# Altium project Thermal Camera.PrjPcb
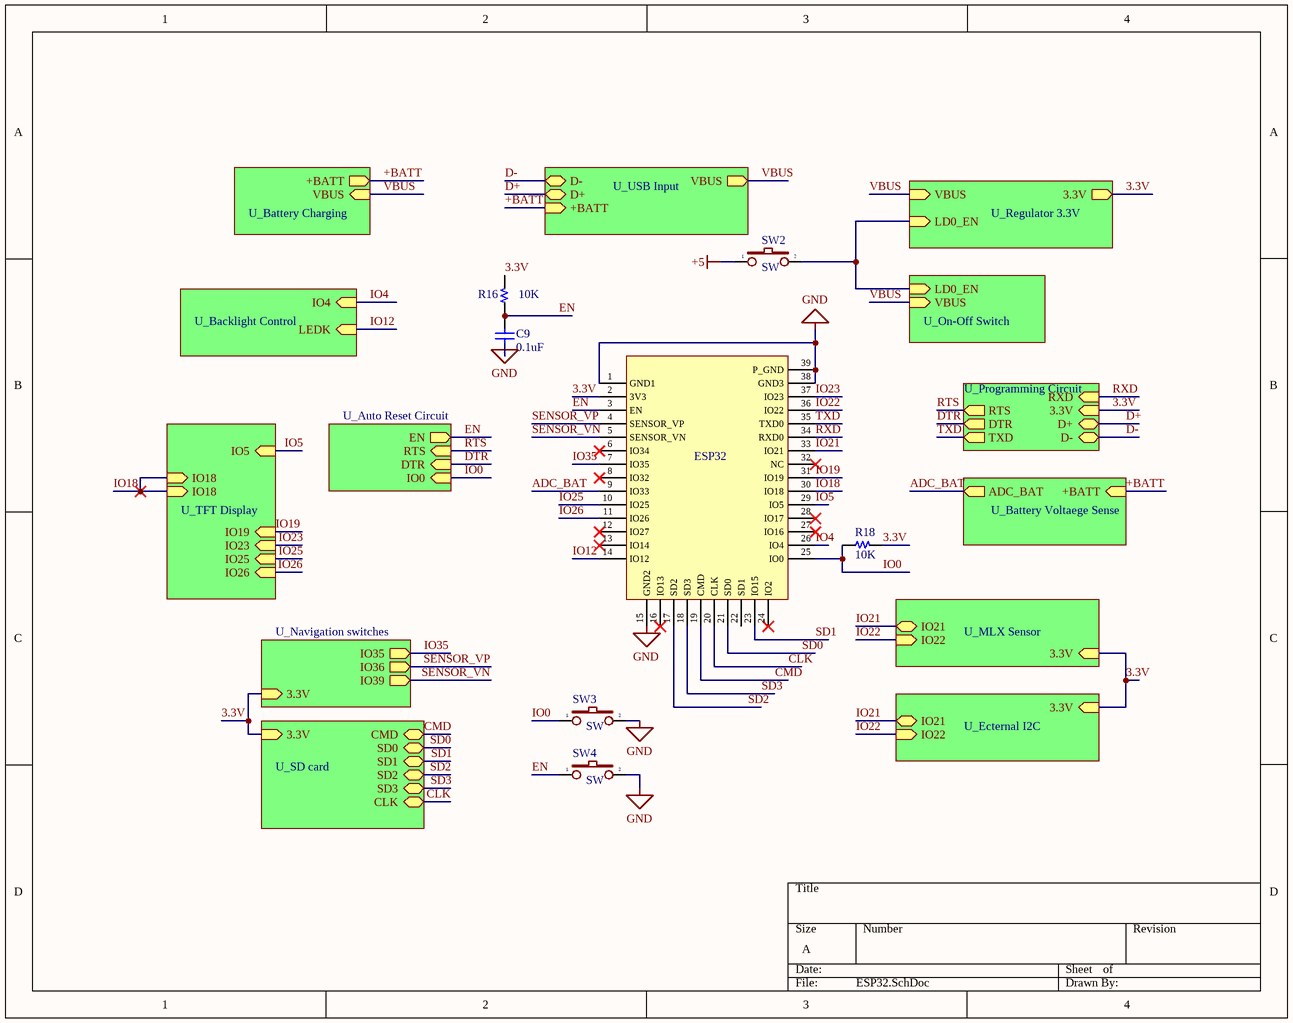
[diagram p0: ESP32.SchDoc]
12 sheets, 49 parts. Net scope: hierarchical (ports join the sheet entries above them; power ports are global).
Board file: PCB_Thermal.PcbDoc
Sheets:
  ESP32.SchDoc
    U_Programming Circuit = Programming Circuit.SchDoc
    U_Regulator 3.3V = Regulator 3.3V.SchDoc
    U_USB Input = USB Input.SchDoc
    U_Battery Voltaege Sense = Battery Voltaege Sense.SchDoc
    U_Backlight Control = Backlight Control.SchDoc
    U_MLX Sensor = MLX Sensor.SchDoc
    U_Navigation switches = Navigation switches.SchDoc
    U_On-Off Switch = On-Off Switch.SchDoc
    U_SD card = SD card.SchDoc
    U_TFT Display = TFT Display.SchDoc
    U_Battery Charging = Battery Charging.SchDoc

## Sheet ESP32.SchDoc
size A; SheetNumber: 1; SheetTotal: 14

### Parts
C9  0.1uF  [C 0805]
ESP32  ESP32  [ESP_WROOM_32]  (value not drawn)
R16  10K  [R 0805]
R18  10K  [R 0805]
SW2  SW  [SW2]
SW3  SW  [SW2]
SW4  SW  [SW2]

### Sub-sheets
U_Auto Reset Circuit = Auto Reset Circuit.SchDoc (file not in this document): IO0 (in), DTR (in), RTS (in), EN (out)
U_Backlight Control = Backlight Control.SchDoc: LEDK (in), IO4 (in)
U_Battery Charging = Battery Charging.SchDoc: VBUS (in), +BATT (out)
U_Battery Voltaege Sense = Battery Voltaege Sense.SchDoc: +BATT (in), ADC_BAT (out)
U_Ecternal I2C = Ecternal I2C.SchDoc (file not in this document): 3.3V (in), IO21 (bidir), IO22 (in)
U_MLX Sensor = MLX Sensor.SchDoc: 3.3V (in), IO21 (bidir), IO22 (in)
U_Navigation switches = Navigation switches.SchDoc: 3.3V (in), IO35 (out), IO36 (out), IO39 (out)
U_On-Off Switch = On-Off Switch.SchDoc: LD0_EN (in), VBUS (in)
U_Programming Circuit = Programming Circuit.SchDoc: D- (bidir), D+ (bidir), 3.3V (in), RXD (in), TXD (out), DTR (out), RTS (out)
U_Regulator 3.3V = Regulator 3.3V.SchDoc: VBUS (in), 3.3V (out), LD0_EN (in)
U_SD card = SD card.SchDoc: 3.3V (in), CMD (bidir), SD0 (bidir), SD3 (bidir), CLK (bidir), SD1 (bidir), SD2 (bidir)
U_TFT Display = TFT Display.SchDoc: IO26 (in), IO25 (in), IO5 (in), IO23 (in), IO19 (in), IO18 (in), IO18 (in)
U_USB Input = USB Input.SchDoc: VBUS (out), D- (bidir), D+ (bidir), +BATT (in)

### Nets
+5: SW2.1
GND: C9.2 ESP32.1(GND1) ESP32.15(GND2) ESP32.38(GND3) ESP32.39(P_GND) SW3.2 SW4.2
3.3V: ESP32.2(3V3) R16.2 R18.2 ; sheet U_Programming Circuit/3.3V, sheet U_Regulator 3.3V/3.3V, sheet U_MLX Sensor/3.3V, sheet U_Ecternal I2C/3.3V, sheet U_Navigation switches/3.3V, sheet U_SD card/3.3V
+BATT: sheet U_USB Input/+BATT, sheet U_Battery Voltaege Sense/+BATT, sheet U_Battery Charging/+BATT
ADC_BAT: ESP32.9(IO33) ; sheet U_Battery Voltaege Sense/ADC_BAT
CLK: ESP32.20(CLK) ; sheet U_SD card/CLK
CMD: ESP32.19(CMD) ; sheet U_SD card/CMD
D+: sheet U_Programming Circuit/D+, sheet U_USB Input/D+
D-: sheet U_Programming Circuit/D-, sheet U_USB Input/D-
DTR: sheet U_Programming Circuit/DTR, sheet U_Auto Reset Circuit/DTR
EN: C9.1 ESP32.3(EN) R16.1 SW4.1 ; sheet U_Auto Reset Circuit/EN
IO0: ESP32.25(IO0) R18.1 SW3.1 ; sheet U_Auto Reset Circuit/IO0
IO4: ESP32.26(IO4) ; sheet U_Backlight Control/IO4
IO5: ESP32.29(IO5) ; sheet U_TFT Display/IO5
IO12: ESP32.14(IO12) ; sheet U_Backlight Control/LEDK
IO18: ESP32.30(IO18) ; sheet U_TFT Display/IO18, sheet U_TFT Display/IO18
IO19: ESP32.31(IO19) ; sheet U_TFT Display/IO19
IO21: ESP32.33(IO21) ; sheet U_MLX Sensor/IO21, sheet U_Ecternal I2C/IO21
IO22: ESP32.36(IO22) ; sheet U_MLX Sensor/IO22, sheet U_Ecternal I2C/IO22
IO23: ESP32.37(IO23) ; sheet U_TFT Display/IO23
IO25: ESP32.10(IO25) ESP32.11(IO26) ; sheet U_TFT Display/IO26, sheet U_TFT Display/IO25  [also labelled IO26]  [project net 3.3V]
IO35: ESP32.4(SENSOR_VP) ESP32.5(SENSOR_VN) ESP32.7(IO35) ; sheet U_Navigation switches/IO35, sheet U_Navigation switches/IO36, sheet U_Navigation switches/IO39  [also labelled SENSOR_VN, SENSOR_VP]
RTS: sheet U_Programming Circuit/RTS, sheet U_Auto Reset Circuit/RTS
RXD: ESP32.34(RXD0) ; sheet U_Programming Circuit/RXD
SD0: ESP32.21(SD0) ; sheet U_SD card/SD0
SD1: ESP32.23(IO15) ; sheet U_SD card/SD1
SD2: ESP32.17(SD2) ; sheet U_SD card/SD2
SD3: ESP32.18(SD3) ; sheet U_SD card/SD3
TXD: ESP32.35(TXD0) ; sheet U_Programming Circuit/TXD
VBUS: sheet U_Regulator 3.3V/VBUS, sheet U_USB Input/VBUS, sheet U_On-Off Switch/VBUS, sheet U_Battery Charging/VBUS
NetSW1_1: SW2.2 ; sheet U_Regulator 3.3V/LD0_EN, sheet U_On-Off Switch/LD0_EN

Not connected (* = marked no-connect by the designer): ESP32 6(IO34)* 8(IO32)* 12(IO27)* 13(IO14)* 16(IO13)* 22(SD1) 24(IO2)* 27(IO16)* 28(IO17)* 32(NC)*

### Library data of the parts
C9 = Capacitor NP: Capacitor non-pol
ESP32 = ESP-WROOM-32
R16 R18 = Resistor
SW2-SW4 = SW2: Switch button 2 pin; Value: SW chip 2 pin

## Sheet Programming Circuit.SchDoc
size A; SheetNumber: 9; SheetTotal: 14
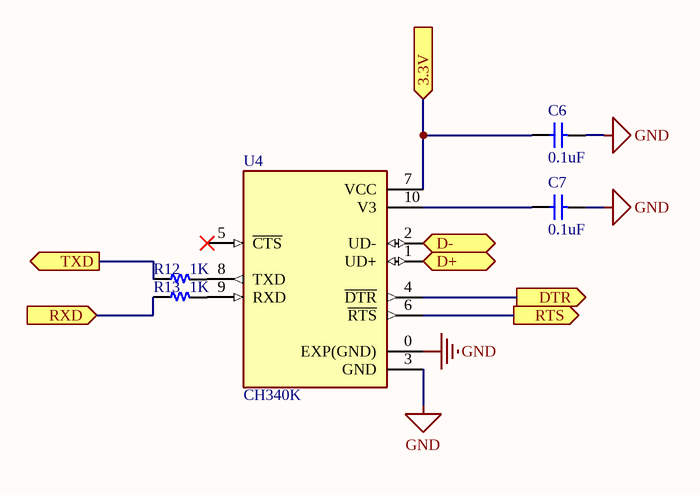
[diagram p1: Programming Circuit.SchDoc]

### Parts
C6  0.1uF  [C 0805]
C7  0.1uF  [C 0805]
R12  1K  [R 0805]
R13  1K  [R 0805]
U4  CH340K  [SOP100P600X160-11N]

### Ports
3.3V (in, see ESP32[4B], Ecternal I2C[2B], MLX Sensor[2B], Navigation switches[2B], Regulator 3.3V[3A], SD card[3B]), D+ (bidir, see ESP32[4B], USB Input[3B]), D- (bidir, see ESP32[4B], USB Input[3B]), DTR (out, see ESP32[3B], Auto Reset Circuit[3B]), RTS (out, see ESP32[3B], Auto Reset Circuit[2B]), RXD (in, see ESP32[4B]), TXD (out, see ESP32[3B])

### Nets
GND: C6.1 C7.1 U4.0(EXP(GND)) U4.3(GND)
3.3V: C6.2 U4.7(VCC) ; port 3.3V
D+: U4.1(UD+) ; port D+
D-: U4.2(UD-) ; port D-
DTR: U4.4(~{DTR}) ; port DTR
RTS: U4.6(~{RTS}) ; port RTS
RXD: R13.1 ; port RXD
TXD: R12.1 ; port TXD
NetC7_2: C7.2 U4.10(V3)
NetR12_2: R12.2 U4.8(TXD)
NetR13_2: R13.2 U4.9(RXD)

Not connected (* = marked no-connect by the designer): U4 5(~{CTS})*

### Library data of the parts
C6 C7 = Capacitor NP: Capacitor non-pol
R12 R13 = Resistor
U4 = CH340K: USB to Serial Port Chip; MF: WCH; SnapEDA_Link: https://www.snapeda.com/parts/CH340K/WCH/view-part/?ref=snap; Package: Package; Value: *; MP: CH340K; Check_prices: https://www.snapeda.com/parts/CH340K/WCH/view-part/?ref=eda

## Sheet Regulator 3.3V.SchDoc
size A; SheetNumber: 2; SheetTotal: 14
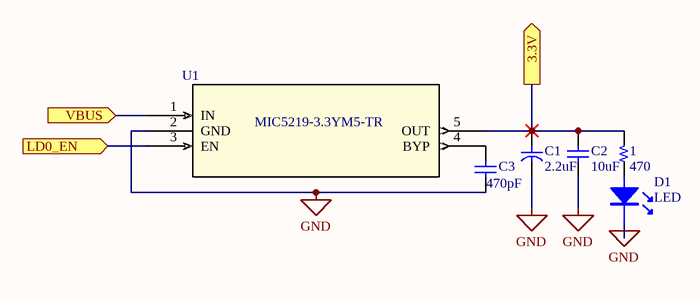
[diagram p2: Regulator 3.3V.SchDoc]

### Parts
1  470  [R 0805]
C1  2.2uF  [C SMD TAN 1206 (A)]
C2  10uF  [C 0805]
C3  470pF  [C 0805]
D1  LED  [CAP10UF]
U1  MIC5219-3.3YM5-TR  [SOT-23-5_M5_MCH]

### Ports
3.3V (out, see ESP32[4A], Ecternal I2C[2B], MLX Sensor[2B], Navigation switches[2B], Programming Circuit[2B], SD card[3B]), LD0_EN (in, see ESP32[3A], On-Off Switch[1B]), VBUS (in, see ESP32[3A], Battery Charging[3B], On-Off Switch[2A], USB Input[3B])

### Nets
GND: C1.2 C2.2 C3.2 D1.2 U1.2(GND)
3.3V: 1.2 C1.1 C2.1 U1.5(OUT) ; port 3.3V
VBUS: U1.1(IN) ; port VBUS
NetC3_1: C3.1 U1.4(BYP)
NetSW1_1: U1.3(EN) ; port LD0_EN

Not connected (* = marked no-connect by the designer): 1 1; D1 1

### Library data of the parts
1 = Resistor
C1 = Capacitor: Capacitor pol
C2 C3 = Capacitor NP: Capacitor non-pol
U1 = MIC5219-3.3YM5-TR: No Description Available; Mfr_Name: Microchip; RefDes: RefDes; Type: Type

## Sheet USB Input.SchDoc
size A; SheetNumber: 4; SheetTotal: 14
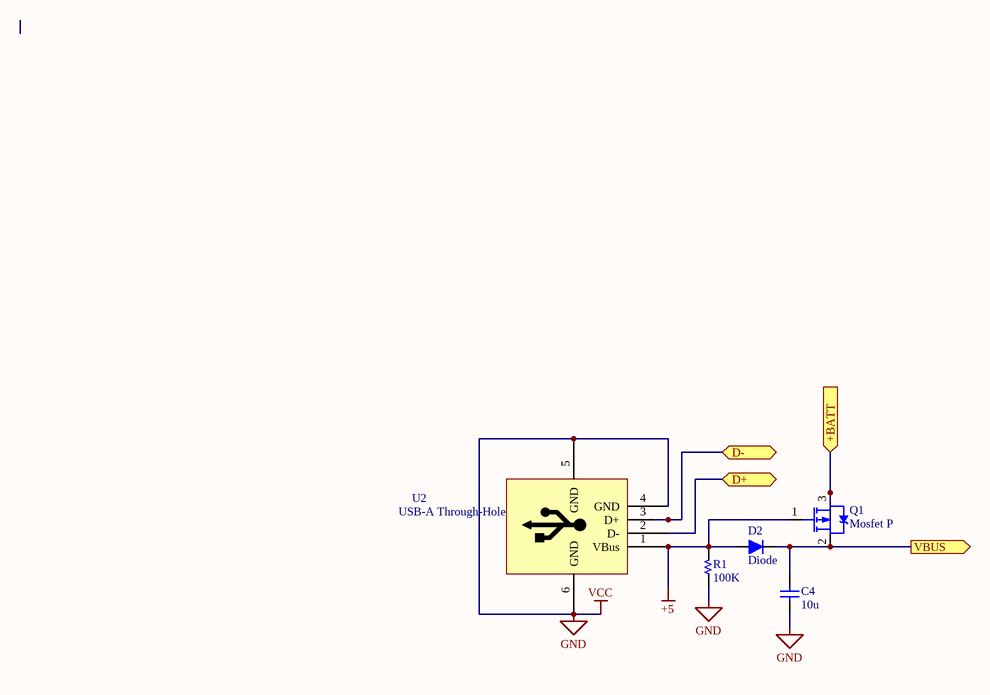
[diagram p3: USB Input.SchDoc]

### Parts
C4  10u  [C 0805]
D2  Diode  [DO-35 (SOD27 )]
Q1  Mosfet P  [SOT-23]
R1  100K  [R 0805]
U2  USB-A Through-Hole  [USB-A]

### Ports
+BATT (in, see ESP32[2A], Battery Charging[2B], Battery Voltaege Sense[2B]), D+ (bidir, see ESP32[2A], Programming Circuit[2B]), D- (bidir, see ESP32[2A], Programming Circuit[2B]), VBUS (out, see ESP32[3A], Battery Charging[3B], On-Off Switch[2A], Regulator 3.3V[1B])

### Nets
+5: D2.1(A) Q1.1(G) R1.2 U2.1(VBus)
GND: C4.2 R1.1 U2.4(GND) U2.5(GND) U2.6(GND)  [also labelled VCC]
+BATT: Q1.3(D) ; port +BATT
D+: U2.2(D-) ; port D+
D-: U2.3(D+) ; port D-
VBUS: C4.1 D2.2(K) Q1.2(S) ; port VBUS

### Library data of the parts
C4 = Capacitor NP: Capacitor non-pol
D2 = Diode: Default Diode
R1 = Resistor
U2 = USB-A TH

## Sheet Battery Voltaege Sense.SchDoc
size A; SheetNumber: 6; SheetTotal: 14
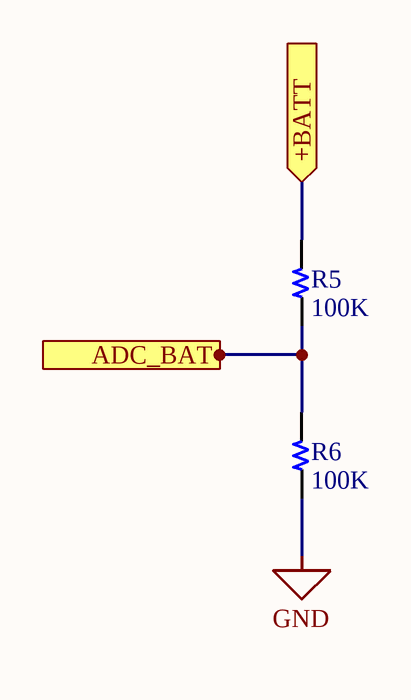
[diagram p4: Battery Voltaege Sense.SchDoc]

### Parts
R5  100K  [R 0805]
R6  100K  [R 0805]

### Ports
+BATT (in, see ESP32[4B], Battery Charging[2B], USB Input[3B]), ADC_BAT (out, see ESP32[3B])

### Nets
GND: R6.1
+BATT: R5.2 ; port +BATT
ADC_BAT: R5.1 R6.2 ; port ADC_BAT

### Library data of the parts
R5 R6 = Resistor

## Sheet Backlight Control.SchDoc
size A; SheetNumber: 7; SheetTotal: 14
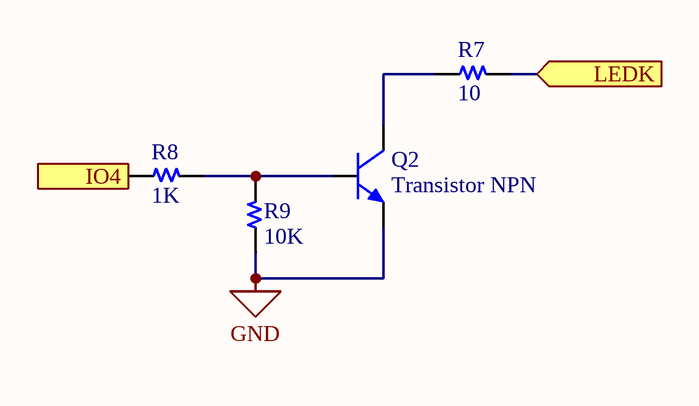
[diagram p5: Backlight Control.SchDoc]

### Parts
Q2  Transistor NPN  [SOT-23]
R7  10  [R 0805]
R8  1K  [R 0805]
R9  10K  [R 0805]

### Ports
IO4 (in, see ESP32[2B]), LEDK (in, see ESP32[2B])

### Nets
GND: Q2.2(E) R9.1
IO4: R8.1 ; port IO4
IO12: R7.2 ; port LEDK
NetQ2_1: Q2.1(B) R8.2 R9.2
NetQ2_3: Q2.3(C) R7.1

### Library data of the parts
Q2 = Transistor NPN: NPN Bipolar Transistor
R7-R9 = Resistor

## Sheet MLX Sensor.SchDoc
size A; SheetNumber: 11; SheetTotal: 14
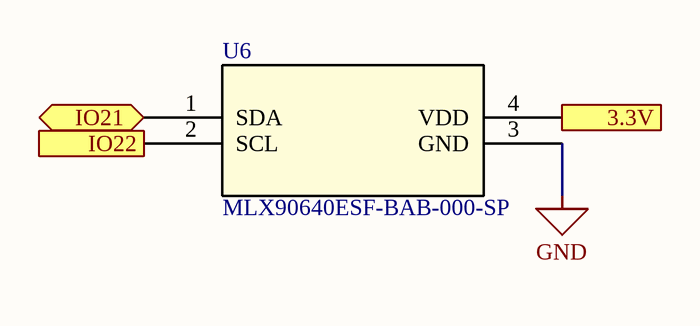
[diagram p6: MLX Sensor.SchDoc]

### Parts
U6  MLX90640ESF-BAB-000-SP  [MLX90640_MEL]

### Ports
3.3V (in, see ESP32[4C], Ecternal I2C[2B], Navigation switches[2B], Programming Circuit[2B], Regulator 3.3V[3A], SD card[3B]), IO21 (bidir, see ESP32[3C], Ecternal I2C[2B]), IO22 (in, see ESP32[3C], Ecternal I2C[2B])

### Nets
GND: U6.3(GND)
3.3V: U6.4(VDD) ; port 3.3V
IO21: U6.1(SDA) ; port IO21
IO22: U6.2(SCL) ; port IO22

### Library data of the parts
U6 = MLX90640ESF-BAB-000-SP: No Description Available; Mfr_Name: Melexis; RefDes: RefDes; Type: Type

## Sheet Navigation switches.SchDoc
size A; SheetNumber: 13; SheetTotal: 14
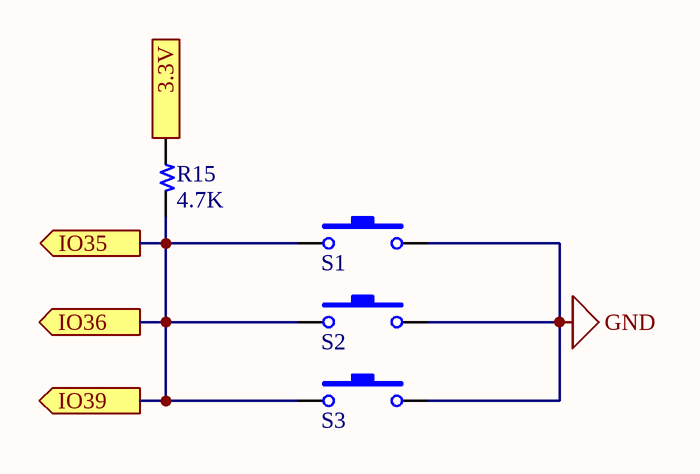
[diagram p7: Navigation switches.SchDoc]

### Parts
R15  4.7K  [R 0805]
S1  SW-SMD  [SW-SMD]  (value not drawn)
S2  SW-SMD  [SW-SMD]  (value not drawn)
S3  SW-SMD  [SW-SMD]  (value not drawn)

### Ports
3.3V (in, see ESP32[1C], Ecternal I2C[2B], MLX Sensor[2B], Programming Circuit[2B], Regulator 3.3V[3A], SD card[3B]), IO35 (out, see ESP32[2C]), IO36 (out, see ESP32[2C]), IO39 (out, see ESP32[2C])

### Nets
GND: S1.2 S2.2 S3.2
3.3V: R15.1 ; port 3.3V
IO35: R15.2 S1.1 S2.1 S3.1 ; port IO35, port IO36, port IO39

### Library data of the parts
R15 = Resistor
S1-S3 = SW-SMD: Switch; Published: 24-Mar-1999; LatestRevisionDate: 17-Jul-2002; LatestRevisionNote: Re-released for DXP Platform.; PackageReference: SPST-2; Publisher: Altium Limited

## Sheet On-Off Switch.SchDoc
size A; SheetNumber: 3; SheetTotal: 14
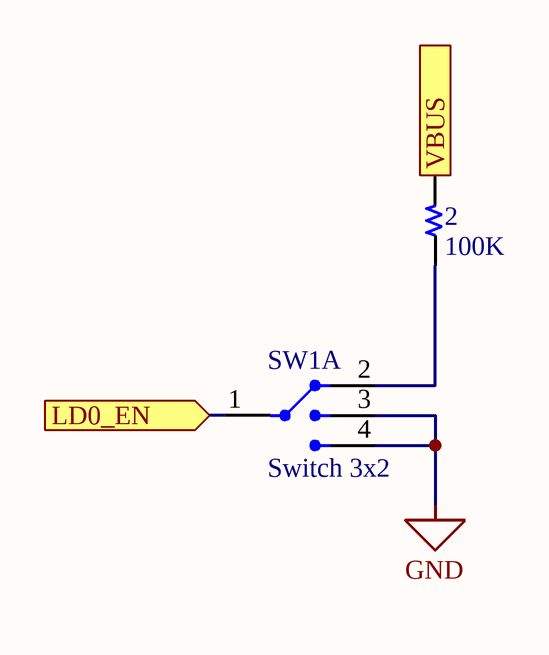
[diagram p8: On-Off Switch.SchDoc]

### Parts
2  100K  [R 0805]
SW1  Switch 3x2  [SW3X2]  (part A of 2)

### Ports
LD0_EN (in, see ESP32[3B], Regulator 3.3V[1B]), VBUS (in, see ESP32[3B], Battery Charging[3B], Regulator 3.3V[1B], USB Input[3B])

### Nets
GND: SW1.3(I/O2) SW1.4(I/O3)
VBUS: 2.2 ; port VBUS
Net2_1: 2.1 SW1.2(I/O1)
NetSW1_1: SW1.1(Com) ; port LD0_EN

### Library data of the parts
2 = Resistor
SW1 = SW3x2: Value: Switch 4x2

## Sheet SD card.SchDoc
size A; SheetNumber: 14; SheetTotal: 14
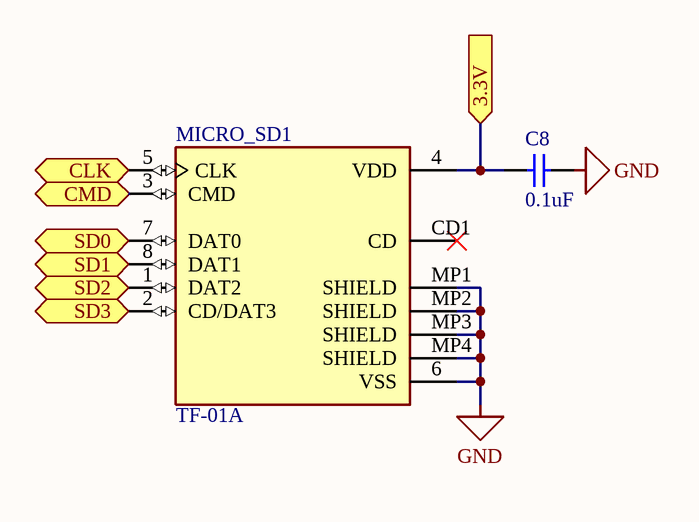
[diagram p9: SD card.SchDoc]

### Parts
C8  0.1uF  [C 0805]
MICRO_SD1  TF-01A  [TF-01A]

### Ports
3.3V (in, see ESP32[1C], Ecternal I2C[2B], MLX Sensor[2B], Navigation switches[2B], Programming Circuit[2B], Regulator 3.3V[3A]), CLK (bidir, see ESP32[2D]), CMD (bidir, see ESP32[2C]), SD0 (bidir, see ESP32[2C]), SD1 (bidir, see ESP32[2C]), SD2 (bidir, see ESP32[2D]), SD3 (bidir, see ESP32[2D])

### Nets
GND: C8.2 MICRO_SD1.6(VSS) MICRO_SD1.MP1(SHIELD) MICRO_SD1.MP2(SHIELD) MICRO_SD1.MP3(SHIELD) MICRO_SD1.MP4(SHIELD)
3.3V: C8.1 MICRO_SD1.4(VDD) ; port 3.3V
CLK: MICRO_SD1.5(CLK) ; port CLK
CMD: MICRO_SD1.3(CMD) ; port CMD
SD0: MICRO_SD1.7(DAT0) ; port SD0
SD1: MICRO_SD1.8(DAT1) ; port SD1
SD2: MICRO_SD1.1(DAT2) ; port SD2
SD3: MICRO_SD1.2(CD/DAT3) ; port SD3

Not connected (* = marked no-connect by the designer): MICRO_SD1 CD1(CD)*

### Library data of the parts
C8 = Capacitor NP: Capacitor non-pol
MICRO_SD1 = TF-01A: Standard Card Edge Connectors; MF: HRO Electronics Co., Ltd.; Price: None; Availability: Not in stock; MP: TF-01A; Package: Package; SnapEDA_Link: https://www.snapeda.com/parts/TF-01A/HRO+Electronics+Co.%252C+Ltd./view-part/?ref=snap; Check_prices: https://www.snapeda.com/parts/TF-01A/HRO+Electronics+Co.%252C+Ltd./view-part/?ref=eda; Value: *

## Sheet TFT Display.SchDoc
size A; SheetNumber: 8; SheetTotal: 14
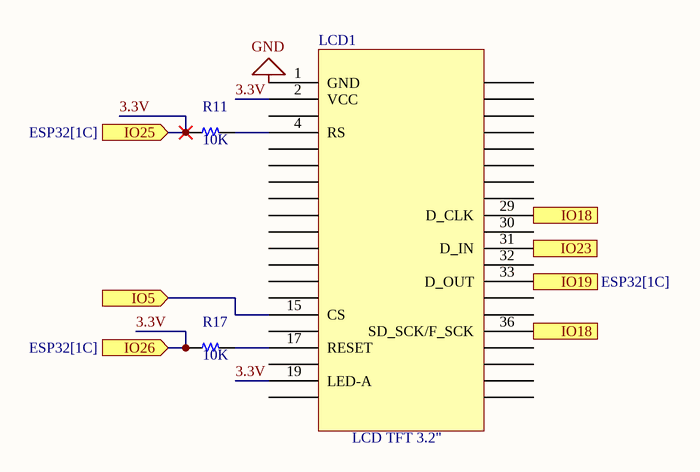
[diagram p10: TFT Display.SchDoc]

### Parts
LCD1  LCD TFT 3.2"  [LCD TFT 3.2"]
R11  10K  [R 0805]
R17  10K  [R 0805]

### Ports
IO5 (in, see ESP32[1B]), IO18 (in, see ESP32[1B]), IO19 (in, see ESP32[1C]), IO23 (in, see ESP32[1C]), IO25 (in, see ESP32[1C]), IO26 (in, see ESP32[1C])

### Nets
GND: LCD1.1(GND)
3.3V: LCD1.2(VCC) LCD1.19(LED-A) R11.1 R17.1 ; port IO26, port IO25
IO5: LCD1.15(CS) ; port IO5
IO18: LCD1.29(D_CLK) LCD1.36(SD_SCK/F_SCK) ; port IO18
IO19: LCD1.33(D_OUT) ; port IO19
IO23: LCD1.31(D_IN) ; port IO23
NetLCD1_4: LCD1.4(RS) R11.2
NetLCD1_17: LCD1.17(RESET) R17.2

Not connected (* = marked no-connect by the designer): LCD1 3(NC) 5(WR) 6(RD) 7(DB8) 8(DB9) 9(DB10) 10(DB11) 11(DB12) 12(DB13) 13(DB14) 14(DB15) 16(F_CS) 18(NC) 20(NC) 21(DB0) 22(DB1) 23(DB2) 24(DB3) 25(DB4) 26(DB5) 27(DB6) 28(DB7) 30(D_CS) 32(D_BUSY) 34(D_Penirg) 35(SD_OUT/F_SI) 37(SD_DIN/F_SO) 38(SD_CS) 39(F_WP) 40(F_HOLD)

### Library data of the parts
LCD1 = LCD TFT 3.2": LCD TFT
R11 R17 = Resistor

## Sheet Battery Charging.SchDoc
size A; SheetNumber: 5; SheetTotal: 14
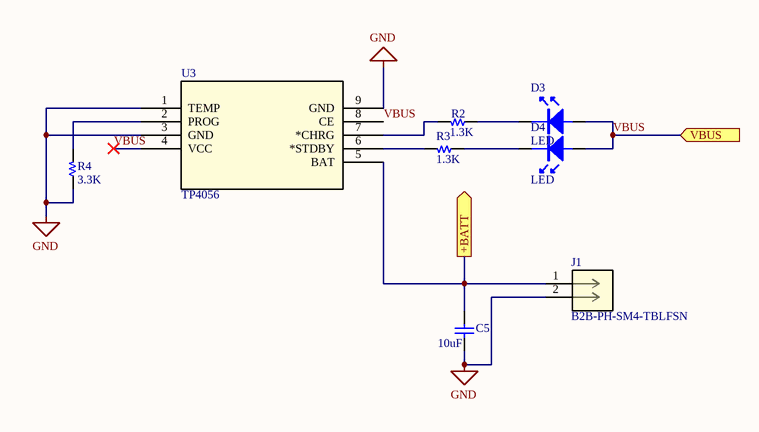
[diagram p11: Battery Charging.SchDoc]

### Parts
C5  10uF  [C 0805]
D3  LED  [CAP10UF]
D4  LED  [CAP10UF]
J1  B2B-PH-SM4-TBLFSN  [CONN_B2B-PH-SM4-TBLFSN_JST]
R2  1.3K  [R 0805]
R3  1.3K  [R 0805]
R4  3.3K  [R 0805]
U3  TP4056  [ESOP8_TPW]

### Ports
+BATT (out, see ESP32[2A], Battery Voltaege Sense[2B], USB Input[2A]), VBUS (in, see ESP32[2A], On-Off Switch[2A], Regulator 3.3V[1B], USB Input[2B])

### Nets
GND: C5.2 J1.2 R4.1 U3.1(TEMP) U3.3(GND) U3.9(GND)
+BATT: C5.1 J1.1 U3.5(BAT) ; port +BATT
VBUS: D3.1 D4.1 U3.4(VCC) U3.8(CE) ; port VBUS
NetD3_2: D3.2 R2.1
NetD4_2: D4.2 R3.1
NetR2_2: R2.2 U3.7(*CHRG)
NetR3_2: R3.2 U3.6(*STDBY)
NetR4_2: R4.2 U3.2(PROG)

### Library data of the parts
C5 = Capacitor NP: Capacitor non-pol
J1 = B2B-PH-SM4-TBLFSN: No Description Available; Mfr_Name: JST; RefDes: RefDes; Type: Type
R2-R4 = Resistor
U3 = TP4056: No Description Available; Mfr_Name: TOPPOWER; RefDes: RefDes; Type: Type

## Nets that join several sheets
+5: ESP32 (SW2.1), USB Input (D2.1 Q1.1 R1.2 U2.1)
GND: ESP32 (7 pins), Programming Circuit (C6.1 C7.1 U4.0 U4.3), Regulator 3.3V (5 pins), USB Input (5 pins), Battery Voltaege Sense (R6.1), Backlight Control (Q2.2 R9.1), MLX Sensor (U6.3), Navigation switches (S1.2 S2.2 S3.2), On-Off Switch (SW1.3 SW1.4), SD card (6 pins), TFT Display (LCD1.1), Battery Charging (6 pins)
3.3V: ESP32 (ESP32.2 R16.2 R18.2), Programming Circuit (C6.2 U4.7), Regulator 3.3V (1.2 C1.1 C2.1 U1.5), MLX Sensor (U6.4), Navigation switches (R15.1), SD card (C8.1 MICRO_SD1.4)
3.3V: ESP32 (ESP32.10 ESP32.11), TFT Display (LCD1.2 LCD1.19 R11.1 R17.1)
+BATT: USB Input (Q1.3), Battery Voltaege Sense (R5.2), Battery Charging (C5.1 J1.1 U3.5)
ADC_BAT: ESP32 (ESP32.9), Battery Voltaege Sense (R5.1 R6.2)
CLK: ESP32 (ESP32.20), SD card (MICRO_SD1.5)
CMD: ESP32 (ESP32.19), SD card (MICRO_SD1.3)
D+: Programming Circuit (U4.1), USB Input (U2.2)
D-: Programming Circuit (U4.2), USB Input (U2.3)
IO4: ESP32 (ESP32.26), Backlight Control (R8.1)
IO5: ESP32 (ESP32.29), TFT Display (LCD1.15)
IO12: ESP32 (ESP32.14), Backlight Control (R7.2)
IO18: ESP32 (ESP32.30), TFT Display (LCD1.29 LCD1.36)
IO19: ESP32 (ESP32.31), TFT Display (LCD1.33)
IO21: ESP32 (ESP32.33), MLX Sensor (U6.1)
IO22: ESP32 (ESP32.36), MLX Sensor (U6.2)
IO23: ESP32 (ESP32.37), TFT Display (LCD1.31)
IO35: ESP32 (ESP32.4 ESP32.5 ESP32.7), Navigation switches (R15.2 S1.1 S2.1 S3.1)
NetSW1_1: ESP32 (SW2.2), Regulator 3.3V (U1.3), On-Off Switch (SW1.1)
RXD: ESP32 (ESP32.34), Programming Circuit (R13.1)
SD0: ESP32 (ESP32.21), SD card (MICRO_SD1.7)
SD1: ESP32 (ESP32.23), SD card (MICRO_SD1.8)
SD2: ESP32 (ESP32.17), SD card (MICRO_SD1.1)
SD3: ESP32 (ESP32.18), SD card (MICRO_SD1.2)
TXD: ESP32 (ESP32.35), Programming Circuit (R12.1)
VBUS: Regulator 3.3V (U1.1), USB Input (C4.1 D2.2 Q1.2), On-Off Switch (2.2), Battery Charging (D3.1 D4.1 U3.4 U3.8)